# Altium project TLV62569ADRLR-power-board-with-mppt-ic.PrjPcb
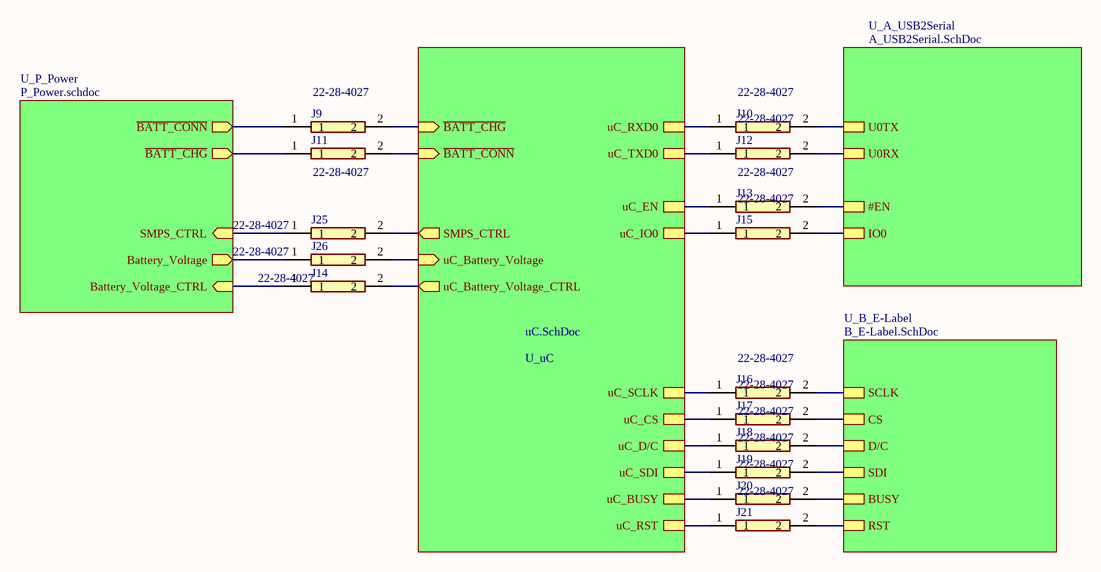
[diagram p0: 0_Top.SchDoc]
5 sheets, 110 parts. Net scope: hierarchical (ports join the sheet entries above them; power ports are global).
Board file: PCB1.PcbDoc
Sheets:
  0_Top.SchDoc
    U_A_USB2Serial = A_USB2Serial.SchDoc
    U_B_E-Label = B_E-Label.SchDoc
    U_P_Power = P_Power.schdoc
    U_uC = uC.SchDoc

## Sheet 0_Top.SchDoc
size A4; DocumentNumber: 1; SheetNumber: 1; SheetTotal: 5

### Parts
J9  22-28-4027  [HDRV2W66P0X254_1X2_508X249X1067P]
J10  22-28-4027  [HDRV2W66P0X254_1X2_508X249X1067P]
J11  22-28-4027  [HDRV2W66P0X254_1X2_508X249X1067P]
J12  22-28-4027  [HDRV2W66P0X254_1X2_508X249X1067P]
J13  22-28-4027  [HDRV2W66P0X254_1X2_508X249X1067P]
J14  22-28-4027  [HDRV2W66P0X254_1X2_508X249X1067P]
J15  22-28-4027  [HDRV2W66P0X254_1X2_508X249X1067P]
J16  22-28-4027  [HDRV2W66P0X254_1X2_508X249X1067P]
J17  22-28-4027  [HDRV2W66P0X254_1X2_508X249X1067P]
J18  22-28-4027  [HDRV2W66P0X254_1X2_508X249X1067P]
J19  22-28-4027  [HDRV2W66P0X254_1X2_508X249X1067P]
J20  22-28-4027  [HDRV2W66P0X254_1X2_508X249X1067P]
J21  22-28-4027  [HDRV2W66P0X254_1X2_508X249X1067P]
J25  22-28-4027  [HDRV2W66P0X254_1X2_508X249X1067P]
J26  22-28-4027  [HDRV2W66P0X254_1X2_508X249X1067P]

### Sub-sheets
U_A_USB2Serial = A_USB2Serial.SchDoc: U0TX, U0RX, #EN, IO0
U_B_E-Label = B_E-Label.SchDoc: SCLK, CS, D/C, SDI, BUSY, RST
U_P_Power = P_Power.schdoc: SMPS_CTRL (in), ~{BATT_CONN} (out), ~{BATT_CHG} (out), Battery_Voltage (out), Battery_Voltage_CTRL (in)
U_uC = uC.SchDoc: uC_TXD0, uC_RXD0, uC_EN, uC_IO0, uC_SDI, uC_CS, uC_D/C, uC_SCLK, uC_BUSY, uC_RST, ~{BATT_CHG} (in), ~{BATT_CONN} (in), SMPS_CTRL (out), uC_Battery_Voltage_CTRL (out), uC_Battery_Voltage (in)

### Nets
#EN: J13.2 ; sheet U_A_USB2Serial/#EN
~{BATT_CHG}: J11.1 ; sheet U_P_Power/~{BATT_CHG}
~{BATT_CONN}: J9.1 ; sheet U_P_Power/~{BATT_CONN}
BUSY: J20.2 ; sheet U_B_E-Label/BUSY
CS: J17.2 ; sheet U_B_E-Label/CS
D/C: J18.2 ; sheet U_B_E-Label/D/C
EN: J13.1 ; sheet U_uC/uC_EN
IO0: J15.2 ; sheet U_A_USB2Serial/IO0
IO2: J20.1 ; sheet U_uC/uC_BUSY
IO3: J21.1 ; sheet U_uC/uC_RST
IO4: J18.1 ; sheet U_uC/uC_D/C
IO5: J9.2 ; sheet U_uC/~{BATT_CHG}
IO6: J11.2 ; sheet U_uC/~{BATT_CONN}
IO7: J26.2 ; sheet U_uC/uC_Battery_Voltage
IO8: J14.2 ; sheet U_uC/uC_Battery_Voltage_CTRL
IO9: J25.2 ; sheet U_uC/SMPS_CTRL
IO13: J16.1 ; sheet U_uC/uC_SCLK
IO14: J19.1 ; sheet U_uC/uC_SDI
IO15: J17.1 ; sheet U_uC/uC_CS
RST: J21.2 ; sheet U_B_E-Label/RST
RXD0: J10.1 ; sheet U_uC/uC_RXD0
SCLK: J16.2 ; sheet U_B_E-Label/SCLK
SDI: J19.2 ; sheet U_B_E-Label/SDI
TXD0: J12.1 ; sheet U_uC/uC_TXD0
U0RX: J12.2 ; sheet U_A_USB2Serial/U0RX
U0TX: J10.2 ; sheet U_A_USB2Serial/U0TX
uC_IO0: J15.1 ; sheet U_uC/uC_IO0
NetJ14_1: J14.1 ; sheet U_P_Power/Battery_Voltage_CTRL
NetJ25_1: J25.1 ; sheet U_P_Power/SMPS_CTRL
NetJ26_1: J26.1 ; sheet U_P_Power/Battery_Voltage

### Library data of the parts
J9-J21 J25 J26 = 22-28-4027: Connector; Manufacturer_Name: Molex; Datasheet Link: https://componentsearchengine.com//22-28-4027.pdf; Height: 10.67mm; Mouser2 Part Number: 538-22-28-4027; Mouser2 Price/Stock: https://www.mouser.com/Search/Refine.aspx?Keyword=538-22-28-4027; Manufacturer_Part_Number: 22-28-4027

## Sheet A_USB2Serial.SchDoc
size A4; DocumentNumber: 3; SheetNumber: 3; SheetTotal: 5
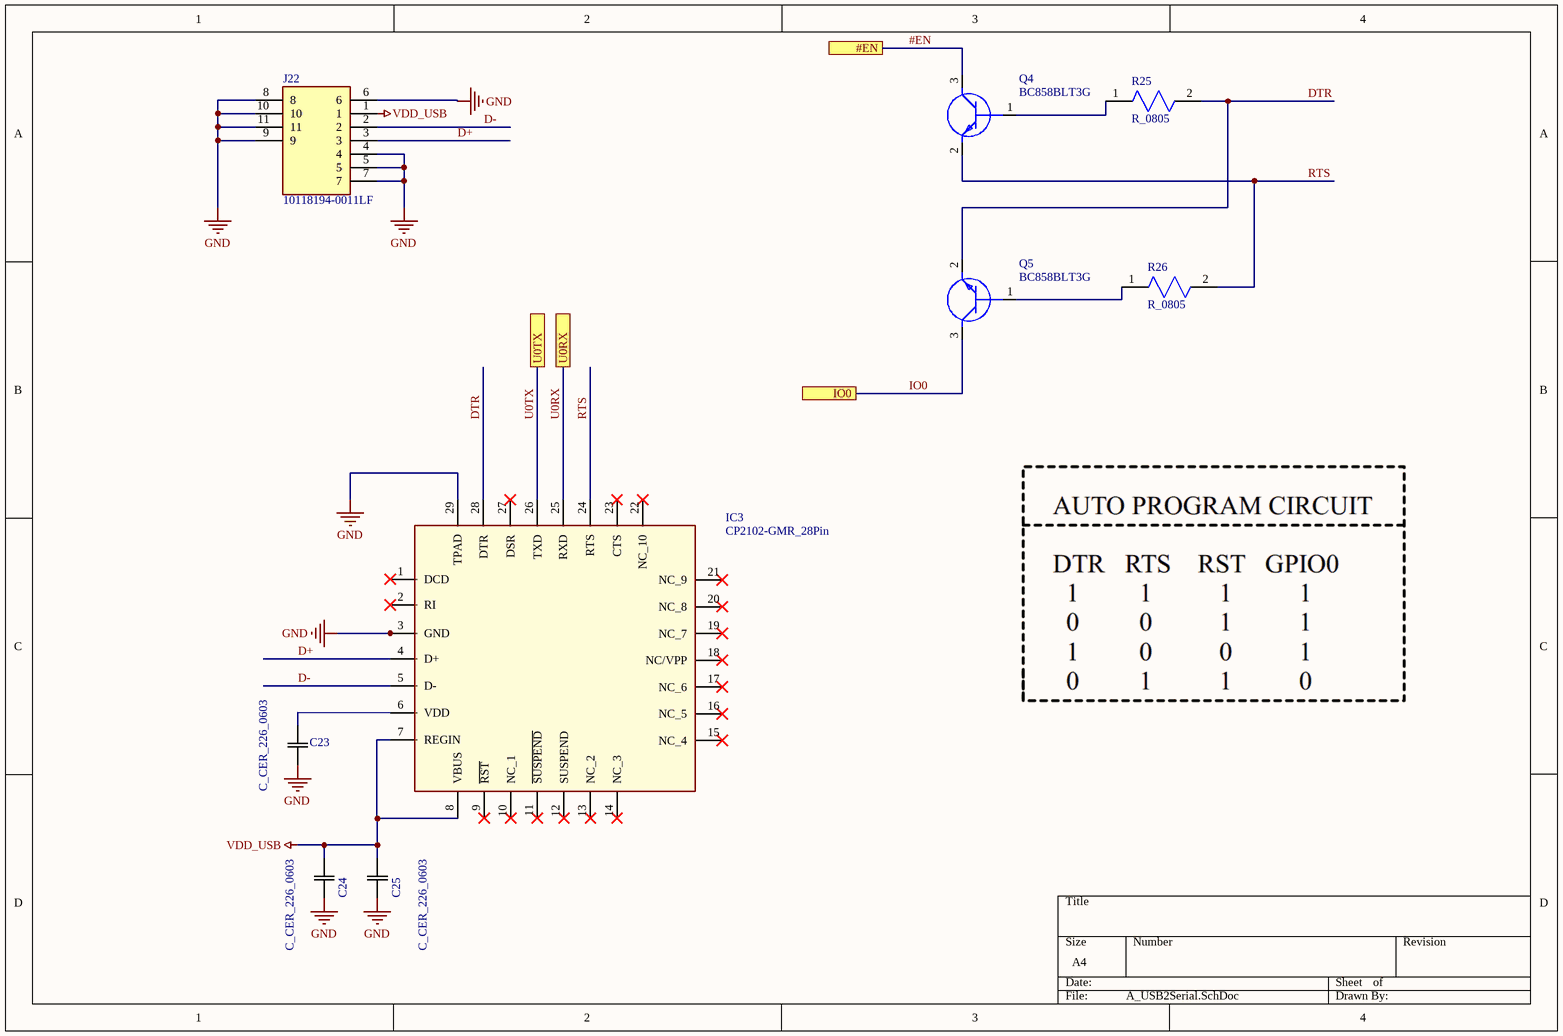
[diagram p1: A_USB2Serial.SchDoc]

### Parts
C23  C_CER_226_0603  [CAPC1608X90N]
C24  C_CER_226_0603  [CAPC1608X90N]
C25  C_CER_226_0603  [CAPC1608X90N]
IC3  CP2102-GMR_28Pin  [QFN50P500X500X100-29N-D]
J22  10118194-0011LF  [101181940011LF]
Q4  BC858BLT3G  [SOT96P237X111-3N]
Q5  BC858BLT3G  [SOT96P237X111-3N]
R25  R_0805  [RESC2012X55N]
R26  R_0805  [RESC2012X55N]

### Ports
#EN, IO0, U0RX, U0TX

### Nets
GND: C23.1 C24.1 C25.1 IC3.3(GND) IC3.29(TPAD) J22.4 J22.5 J22.6 J22.7 J22.8 J22.9 J22.10 J22.11
VDD_USB: C24.2 C25.2 IC3.7(REGIN) IC3.8(VBUS) J22.1
#EN: Q4.3(C) ; port #EN
D+: IC3.4(D+) J22.3
D-: IC3.5(D-) J22.2
DTR: IC3.28(DTR) Q5.2(E) R25.2
IO0: Q5.3(C) ; port IO0
RTS: IC3.24(RTS) Q4.2(E) R26.2
U0RX: IC3.25(RXD) ; port U0RX
U0TX: IC3.26(TXD) ; port U0TX
NetC23_2: C23.2 IC3.6(VDD)
NetQ4_1: Q4.1(B) R25.1
NetQ5_1: Q5.1(B) R26.1

Not connected (* = marked no-connect by the designer): IC3 1(DCD)* 2(RI)* 9(~{RST})* 10(NC_1)* 11(~{SUSPEND})* 12(SUSPEND)* 13(NC_2)* 14(NC_3)* 15(NC_4)* 16(NC_5)* 17(NC_6)* 18(NC/VPP)* 19(NC_7)* 20(NC_8)* 21(NC_9)* 22(NC_10)* 23(CTS)* 27(DSR)*

### Library data of the parts
C23-C25 = C_CER_226_0603: Manufacturer_Part_Number: GRM188R60J226MEA0D; Vendor: Murata; SourceLibrary: Murata_2014-12-31; Type: DEV; Copyright: Copyright (C) 2015 Accelerated Designs. All rights reserved; RefDes: RefDes
IC3 = CP2102-GMR_28Pin: Integrated Circuit; Manufacturer_Name: Silicon Labs; Datasheet Link: https://www.silabs.com/Support%20Documents/TechnicalDocs/CP2102-9.pdf; Height: 1mm; Manufacturer_Part_Number: CP2102-GMR
J22 = 10118194-0011LF: Connector; Manufacturer_Name: Amphenol; Datasheet Link: https://cdn.amphenol-icc.com/media/wysiwyg/files/drawing/10118194.pdf; Height: 2mm; Manufacturer_Part_Number: 10118194-0011LF
Q4 Q5 = BC858BLT3G: Transistor BJT PNP; Manufacturer_Name: ON Semiconductor; Datasheet Link: https://www.onsemi.com/pub/Collateral/BC856ALT1-D.PDF; Height: 1.11mm; Manufacturer_Part_Number: BC858BLT3G
R25 R26 = R_0805: Resistor; Manufacturer_Name: Vishay; Datasheet Link: http://www.vishay.com/docs/20035/dcrcwe3.pdf; Height: 0.4mm

## Sheet B_E-Label.SchDoc
size A4; DocumentNumber: 4; SheetNumber: 4; SheetTotal: 5
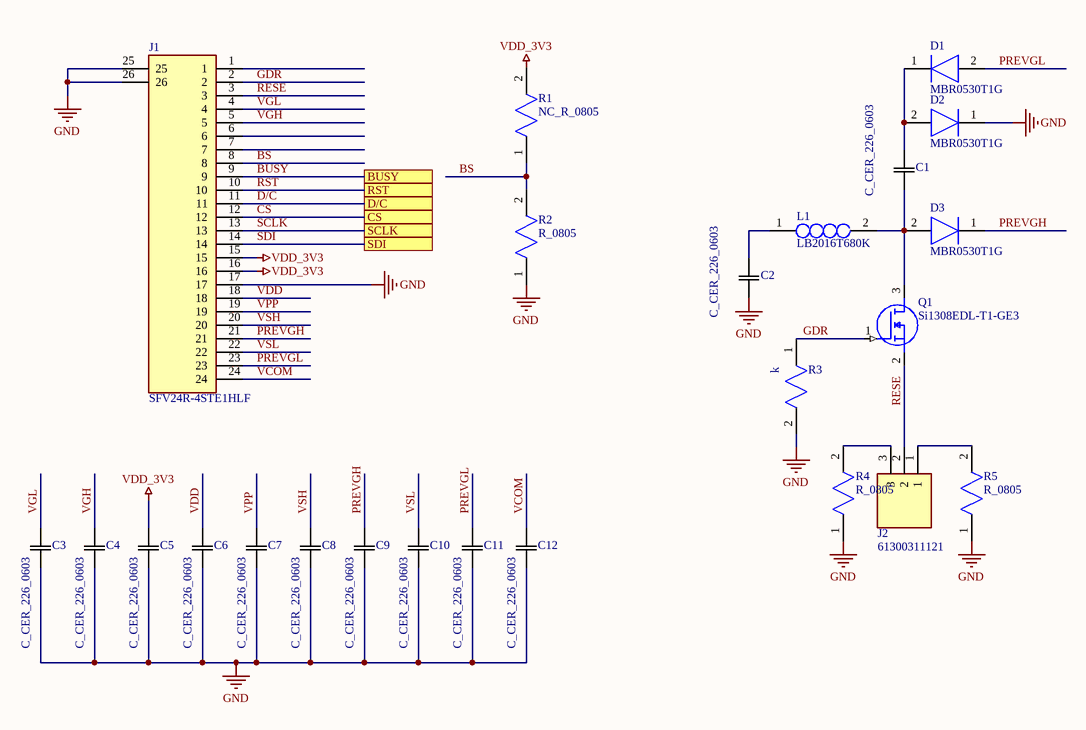
[diagram p2: B_E-Label.SchDoc]

### Parts
C1  C_CER_226_0603  [CAPC1608X90N]
C2  C_CER_226_0603  [CAPC1608X90N]
C3  C_CER_226_0603  [CAPC1608X90N]
C4  C_CER_226_0603  [CAPC1608X90N]
C5  C_CER_226_0603  [CAPC1608X90N]
C6  C_CER_226_0603  [CAPC1608X90N]
C7  C_CER_226_0603  [CAPC1608X90N]
C8  C_CER_226_0603  [CAPC1608X90N]
C9  C_CER_226_0603  [CAPC1608X90N]
C10  C_CER_226_0603  [CAPC1608X90N]
C11  C_CER_226_0603  [CAPC1608X90N]
C12  C_CER_226_0603  [CAPC1608X90N]
D1  MBR0530T1G  [SOD3716X135N]
D2  MBR0530T1G  [SOD3716X135N]
D3  MBR0530T1G  [SOD3716X135N]
J1  SFV24R-4STE1HLF  [SFV24R4STE1HLF]
J2  61300311121  [HDRV3W95P0X254_1X3_762X254X869P]
L1  LB2016T680K  [INDC2218X180N]
Q1  Si1308EDL-T1-GE3  [SOT65P210X110-3N]
R1  NC_R_0805  [RESC2012X55N]
R2  R_0805  [RESC2012X55N]
R3  k  [RESC1005X40N]
R4  R_0805  [RESC2012X55N]
R5  R_0805  [RESC2012X55N]

### Ports
BUSY, CS, D/C, RST, SCLK, SDI

### Nets
GND: C2.1 C3.1 C4.1 C5.1 C6.1 C7.1 C8.1 C9.1 C10.1 C11.1 C12.1 D2.1(K) J1.17 J1.25 J1.26 R2.1 R3.2 R4.1 R5.1
VDD_3V3: C5.2 J1.15 J1.16 R1.2
BS: J1.8 R1.1 R2.2
BUSY: J1.9 ; port BUSY
CS: J1.12 ; port CS
D/C: J1.11 ; port D/C
GDR: J1.2 Q1.1(G) R3.1
PREVGH: C9.2 D3.1(K) J1.21
PREVGL: C11.2 D1.2(A) J1.23
RESE: J1.3 J2.2 Q1.2(S)
RST: J1.10 ; port RST
SCLK: J1.13 ; port SCLK
SDI: J1.14 ; port SDI
VCOM: C12.2 J1.24
VDD: C6.2 J1.18
VGH: C4.2 J1.5
VGL: C3.2 J1.4
VPP: C7.2 J1.19
VSH: C8.2 J1.20
VSL: C10.2 J1.22
NetC1_1: C1.1 D3.2(A) L1.2 Q1.3(D)
NetC1_2: C1.2 D1.1(K) D2.2(A)
NetC2_2: C2.2 L1.1
NetJ2_1: J2.1 R5.2
NetJ2_3: J2.3 R4.2

Not connected (* = marked no-connect by the designer): J1 1 6 7

### Library data of the parts
C1-C12 = C_CER_226_0603: as C23 on sheet A_USB2Serial; Copyright: Copyright (C) 2015 Accelerated Designs. All rights reserved; RefDes: RefDes
D1-D3 = MBR0530T1G: Diode; Manufacturer_Name: ON Semiconductor; Datasheet Link: https://componentsearchengine.com//MBR0530T1G.pdf; Height: 1.35mm; Mouser2 Part Number: 863-MBR0530T1G; Mouser2 Price/Stock: https://www.mouser.com/Search/Refine.aspx?Keyword=863-MBR0530T1G; Manufacturer_Part_Number: MBR0530T1G
J1 = SFV24R-4STE1HLF: Connector; Manufacturer_Name: Amphenol; Datasheet Link: https://www.mouser.co.uk/datasheet/2/18/10117319-1361747.pdf; Height: 2mm; Manufacturer_Part_Number: SFV24R-4STE1HLF
J2 = 61300311121: Connector; Manufacturer_Name: Wurth Elektronik; Datasheet Link: https://componentsearchengine.com//61300311121.pdf; Height: 8.69mm; Mouser2 Part Number: 710-61300311121; Mouser2 Price/Stock: https://www.mouser.com/Search/Refine.aspx?Keyword=710-61300311121; Manufacturer_Part_Number: 61300311121
L1 = LB2016T680K: Inductor; Manufacturer_Name: TAIYO YUDEN; Datasheet Link: https://www.arrow.com/en/products/lb2016t680k/taiyo-yuden; Height: 1.8mm; Manufacturer_Part_Number: LB2016T680K; Arrow Part Number: LB2016T680K
Q1 = Si1308EDL-T1-GE3: MOSFET (N-Channel); Manufacturer_Name: Vishay; Datasheet Link: https://componentsearchengine.com//SI1308EDL-T1-GE3.pdf; Height: 1.1mm; Mouser2 Part Number: 78-SI1308EDL-T1-GE3; Mouser2 Price/Stock: https://www.mouser.com/Search/Refine.aspx?Keyword=78-SI1308EDL-T1-GE3; Manufacturer_Part_Number: Si1308EDL-T1-GE3
R1 R2 R4 R5 = R_0805: Resistor; Manufacturer_Name: Vishay; Datasheet Link: http://www.vishay.com/docs/20035/dcrcwe3.pdf; Height: 0.4mm
R3 = CRCW0402100KFKED: Resistor; Manufacturer_Name: Vishay; Datasheet Link: http://www.vishay.com/docs/20035/dcrcwe3.pdf; Height: 0.4mm; Manufacturer_Part_Number: CRCW0402100KFKED

## Sheet P_Power.schdoc
size 406 x 228 mm; DocumentNumber: 2; SheetNumber: 2; SheetTotal: 5
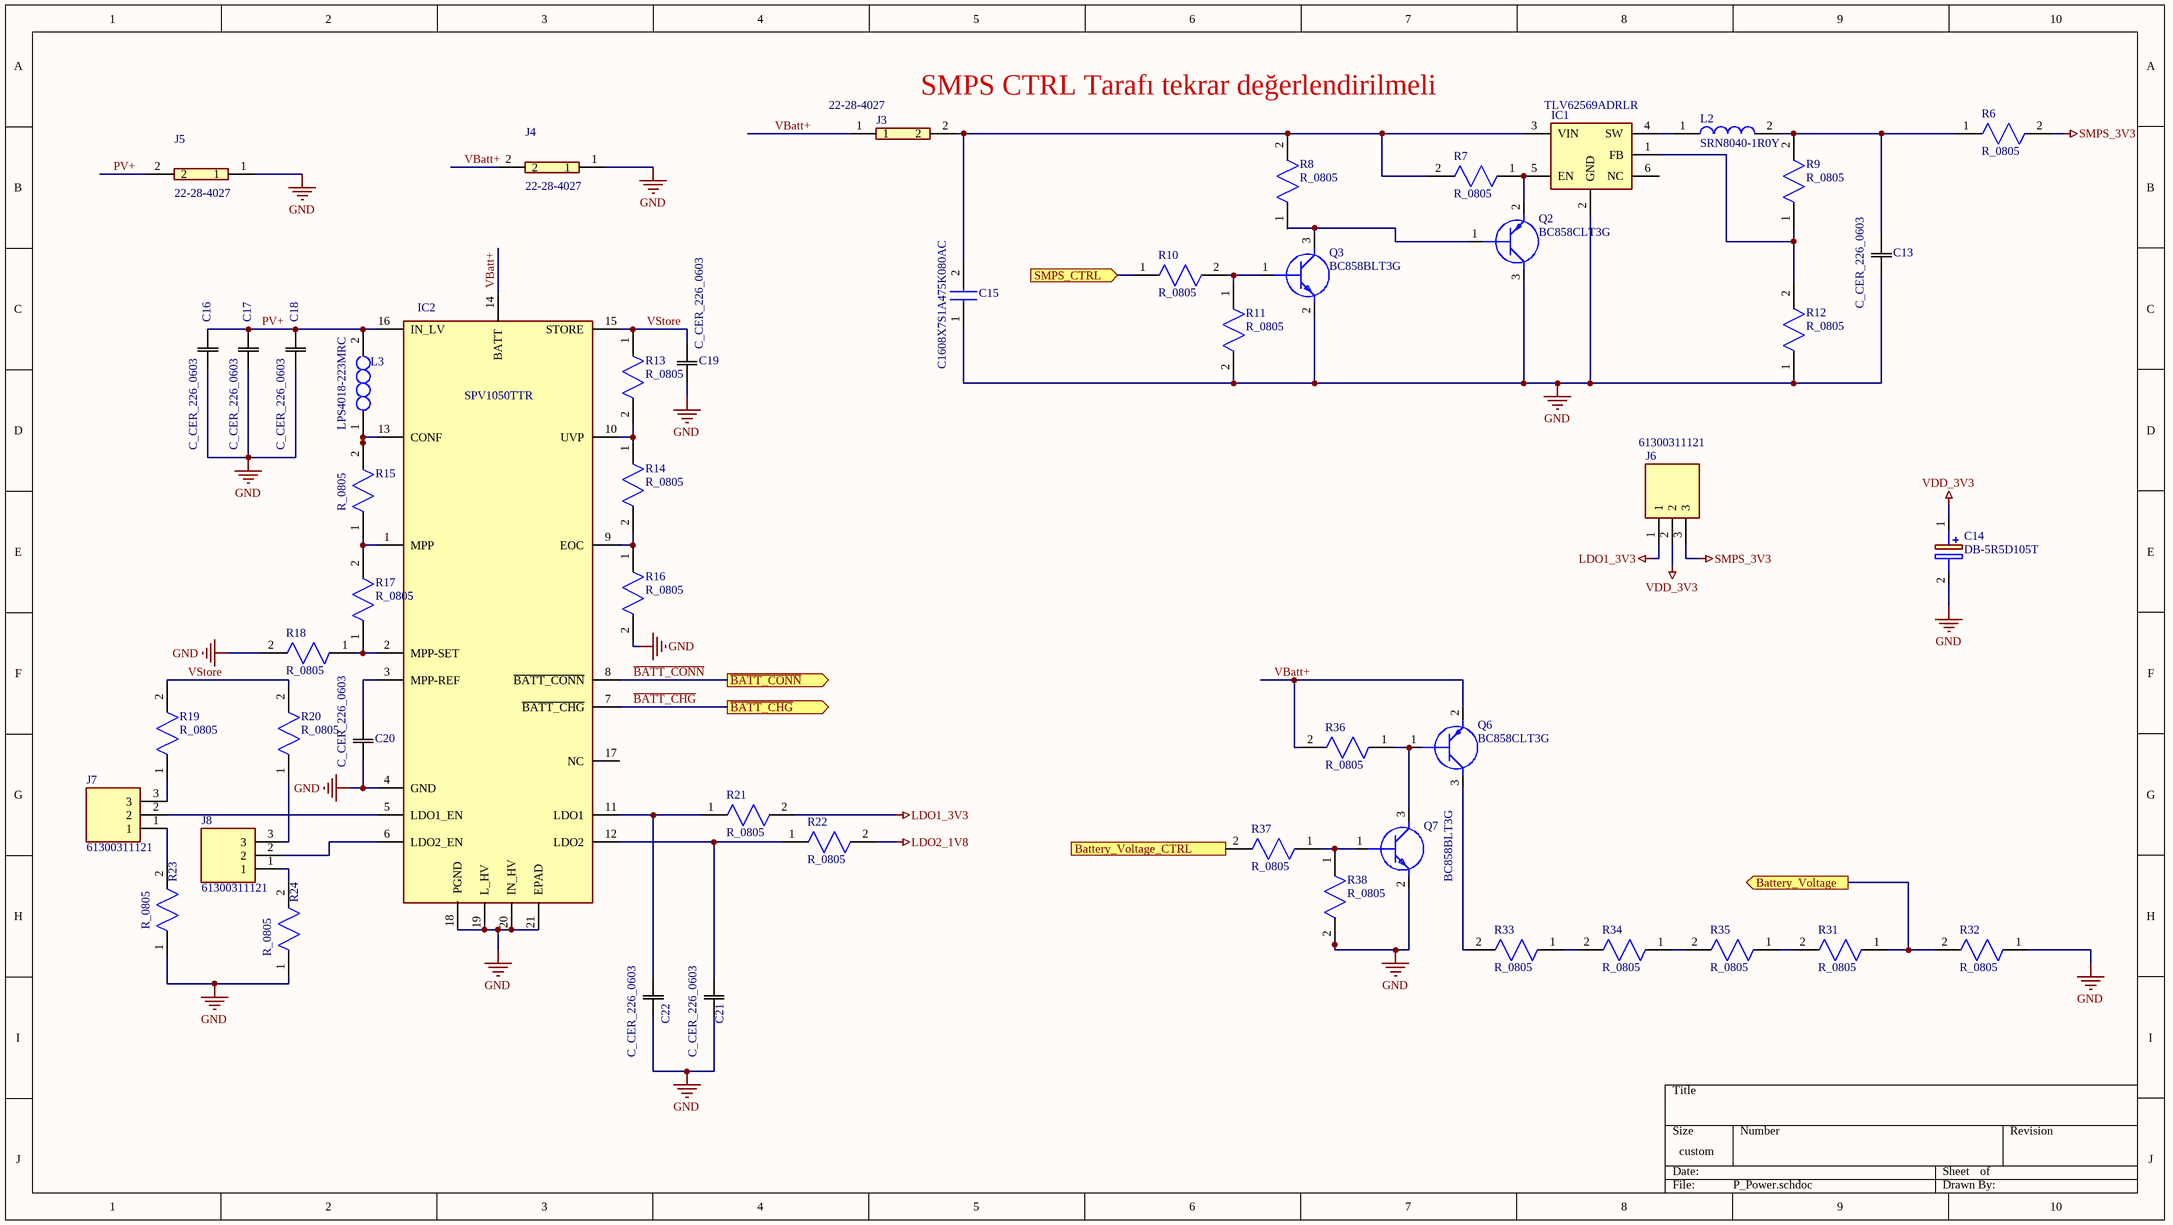
[diagram p3: P_Power.schdoc]

### Parts
C13  C_CER_226_0603  [CAPC1608X90N]
C14  DB-5R5D105T  [CAPPRD500W130D2150H800]
C15  C1608X7S1A475K080AC  [CAPC1608X90N]
C16  C_CER_226_0603  [CAPC1608X90N]
C17  C_CER_226_0603  [CAPC1608X90N]
C18  C_CER_226_0603  [CAPC1608X90N]
C19  C_CER_226_0603  [CAPC1608X90N]
C20  C_CER_226_0603  [CAPC1608X90N]
C21  C_CER_226_0603  [CAPC1608X90N]
C22  C_CER_226_0603  [CAPC1608X90N]
IC1  TLV62569ADRLR  [SOTFL50P160X60-6N]
IC2  SPV1050TTR  [QFN40P300X300X100-21N-D]
J3  22-28-4027  [HDRV2W66P0X254_1X2_508X249X1067P]
J4  22-28-4027  [HDRV2W66P0X254_1X2_508X249X1067P]
J5  22-28-4027  [HDRV2W66P0X254_1X2_508X249X1067P]
J6  61300311121  [HDRV3W95P0X254_1X3_762X254X869P]
J7  61300311121  [HDRV3W95P0X254_1X3_762X254X869P]
J8  61300311121  [HDRV3W95P0X254_1X3_762X254X869P]
L2  SRN8040-1R0Y  [SRN80408R2Y]
L3  LPS4018-223MRC  [LPS4018223MRC]
Q2  BC858CLT3G  [BC858CLT3G]
Q3  BC858BLT3G  [SOT96P237X111-3N]
Q6  BC858CLT3G  [BC858CLT3G]
Q7  BC858BLT3G  [SOT96P237X111-3N]
R6  R_0805  [RESC2012X55N]
R7  R_0805  [RESC2012X55N]
R8  R_0805  [RESC2012X55N]
R9  R_0805  [RESC2012X55N]
R10  R_0805  [RESC2012X55N]
R11  R_0805  [RESC2012X55N]
R12  R_0805  [RESC2012X55N]
R13  R_0805  [RESC2012X55N]
R14  R_0805  [RESC2012X55N]
R15  R_0805  [RESC2012X55N]
R16  R_0805  [RESC2012X55N]
R17  R_0805  [RESC2012X55N]
R18  R_0805  [RESC2012X55N]
R19  R_0805  [RESC2012X55N]
R20  R_0805  [RESC2012X55N]
R21  R_0805  [RESC2012X55N]
R22  R_0805  [RESC2012X55N]
R23  R_0805  [RESC2012X55N]
R24  R_0805  [RESC2012X55N]
R31  R_0805  [RESC2012X55N]
R32  R_0805  [RESC2012X55N]
R33  R_0805  [RESC2012X55N]
R34  R_0805  [RESC2012X55N]
R35  R_0805  [RESC2012X55N]
R36  R_0805  [RESC2012X55N]
R37  R_0805  [RESC2012X55N]
R38  R_0805  [RESC2012X55N]

### Ports
Battery_Voltage (out), Battery_Voltage_CTRL (in), SMPS_CTRL (in), ~{BATT_CHG} (out), ~{BATT_CONN} (out)

### Nets
GND: C13.1 C14.2(-) C15.1 C16.1 C17.1 C18.1 C19.1 C20.1 C21.1 C22.1 IC1.2(GND) IC2.4(GND) IC2.18(PGND) IC2.19(L_HV) IC2.20(IN_HV) IC2.21(EPAD) J4.1 J5.1 Q2.3(C) Q3.2(E) Q7.2(E) R11.2 R12.1 R16.2 R18.2 R23.1 R24.1 R32.1 R38.2
LDO1_3V3: J6.1 R21.2
LDO2_1V8: R22.2
SMPS_3V3: J6.3 R6.2
VDD_3V3: C14.1(+) J6.2
~{BATT_CHG}: IC2.7(~{BATT_CHG}) ; port ~{BATT_CHG}
~{BATT_CONN}: IC2.8(~{BATT_CONN}) ; port ~{BATT_CONN}
PV+: C16.2 C17.2 C18.2 IC2.16(IN_LV) J5.2 L3.2
VBatt+: IC2.14(BATT) J3.1 J4.2 Q6.2(E) R36.2
VStore: C19.2 IC2.15(STORE) R13.1 R19.2 R20.2
NetC13_2: C13.2 L2.2 R6.1 R9.2
NetC15_2: C15.2 IC1.3(VIN) J3.2 R7.2 R8.2
NetC20_2: C20.2 IC2.3(MPP-REF)
NetC21_2: C21.2 IC2.12(LDO2) R22.1
NetC22_2: C22.2 IC2.11(LDO1) R21.1
NetIC1_1: IC1.1(FB) R9.1 R12.2
NetIC1_4: IC1.4(SW) L2.1
NetIC1_5: IC1.5(EN) Q2.2(E) R7.1
NetIC2_1: IC2.1(MPP) R15.1 R17.2
NetIC2_2: IC2.2(MPP-SET) R17.1 R18.1
NetIC2_5: IC2.5(LDO1_EN) J7.2
NetIC2_6: IC2.6(LDO2_EN) J8.2
NetIC2_9: IC2.9(EOC) R14.2 R16.1
NetIC2_10: IC2.10(UVP) R13.2 R14.1
NetIC2_13: IC2.13(CONF) L3.1 R15.2
NetJ7_1: J7.1 R23.2
NetJ7_3: J7.3 R19.1
NetJ8_1: J8.1 R24.2
NetJ8_3: J8.3 R20.1
NetJ14_1: R37.2 ; port Battery_Voltage_CTRL
NetJ25_1: R10.1 ; port SMPS_CTRL
NetJ26_1: R31.1 R32.2 ; port Battery_Voltage
NetQ2_1: Q2.1(B) Q3.3(C) R8.1
NetQ3_1: Q3.1(B) R10.2 R11.1
NetQ6_1: Q6.1(B) Q7.3(C) R36.1
NetQ6_3: Q6.3(C) R33.2
NetQ7_1: Q7.1(B) R37.1 R38.1
NetR31_2: R31.2 R35.1
NetR33_1: R33.1 R34.2
NetR34_1: R34.1 R35.2

Not connected (* = marked no-connect by the designer): IC1 6(NC); IC2 17(NC)

### Notes on the sheet
- SMPS CTRL Tarafı tekrar değerlendirilmeli

### Library data of the parts
C13 C16-C22 = C_CER_226_0603: as C23 on sheet A_USB2Serial; Copyright: Copyright (C) 2015 Accelerated Designs. All rights reserved; RefDes: RefDes
C14 = DB-5R5D105T: Capacitor Polarised; Manufacturer_Name: Elna; Datasheet Link: https://componentsearchengine.com//DB-5R5D105T.pdf; Height: 8mm; Mouser2 Part Number: 555-DB-5R5D105T; Mouser2 Price/Stock: https://www.mouser.com/Search/Refine.aspx?Keyword=555-DB-5R5D105T; Manufacturer_Part_Number: DB-5R5D105T
C15 = C1608X7S1A475K080AC: Capacitor; Manufacturer_Name: TDK; Datasheet Link: https://product.tdk.com/info/en/catalog/datasheets/mlcc_commercial_midvoltage_en.pdf; Height: 0.9mm; Manufacturer_Part_Number: C1608X7S1A475K080AC
IC1 = TLV62569ADRLR: Integrated Circuit; Manufacturer_Name: Texas Instruments; Datasheet Link: http://www.ti.com/lit/gpn/tlv62569a; Height: 0.6mm; Manufacturer_Part_Number: TLV62569ADRLR
IC2 = SPV1050TTR: Integrated Circuit; Manufacturer_Name: STMicroelectronics; Datasheet Link: https://componentsearchengine.com//SPV1050TTR.pdf; Height: 1mm; Mouser2 Part Number: 511-SPV1050TTR; Mouser2 Price/Stock: https://www.mouser.com/Search/Refine.aspx?Keyword=511-SPV1050TTR; Manufacturer_Part_Number: SPV1050TTR
J3-J5 = 22-28-4027: Connector; Manufacturer_Name: Molex; Datasheet Link: https://componentsearchengine.com//22-28-4027.pdf; Height: 10.67mm; Mouser2 Part Number: 538-22-28-4027; Mouser2 Price/Stock: https://www.mouser.com/Search/Refine.aspx?Keyword=538-22-28-4027; Manufacturer_Part_Number: 22-28-4027
J6-J8 = 61300311121: as J2 on sheet B_E-Label; Datasheet Link: https://componentsearchengine.com//61300311121.pdf; Height: 8.69mm; Mouser2 Part Number: 710-61300311121; Mouser2 Price/Stock: https://www.mouser.com/Search/Refine.aspx?Keyword=710-61300311121; Manufacturer_Part_Number: 61300311121
L2 = SRN8040-1R0Y: Inductor; Manufacturer_Name: Bourns; Datasheet Link: https://www.bourns.com/pdfs/SRN8040.pdf; Height: 4mm; Manufacturer_Part_Number: SRN8040-1R0Y
L3 = LPS4018-223MRC: Inductor; Manufacturer_Name: COILCRAFT; Datasheet Link: https://componentsearchengine.com//LPS4018-223MRC.pdf; Height: 1.8mm; Mouser2 Part Number: 994-LPS4018-223MRC; Mouser2 Price/Stock: https://www.mouser.com/Search/Refine.aspx?Keyword=994-LPS4018-223MRC; Manufacturer_Part_Number: LPS4018-223MRC
Q2 Q6 = BC858CLT3G: Transistor BJT PNP; Manufacturer_Name: ON Semiconductor; Datasheet Link: https://componentsearchengine.com//BC858CLT3G.pdf; Mouser2 Part Number: 863-BC858CLT3G; Mouser2 Price/Stock: https://www.mouser.com/Search/Refine.aspx?Keyword=863-BC858CLT3G; Manufacturer_Part_Number: BC858CLT3G
Q3 Q7 = BC858BLT3G: as Q4 on sheet A_USB2Serial; Datasheet Link: https://www.onsemi.com/pub/Collateral/BC856ALT1-D.PDF; Height: 1.11mm; Manufacturer_Part_Number: BC858BLT3G
R6-R24 R31-R38 = R_0805: Resistor; Manufacturer_Name: Vishay; Datasheet Link: http://www.vishay.com/docs/20035/dcrcwe3.pdf; Height: 0.4mm

## Sheet uC.SchDoc
size A4; DocumentNumber: 5; SheetNumber: 5; SheetTotal: 5
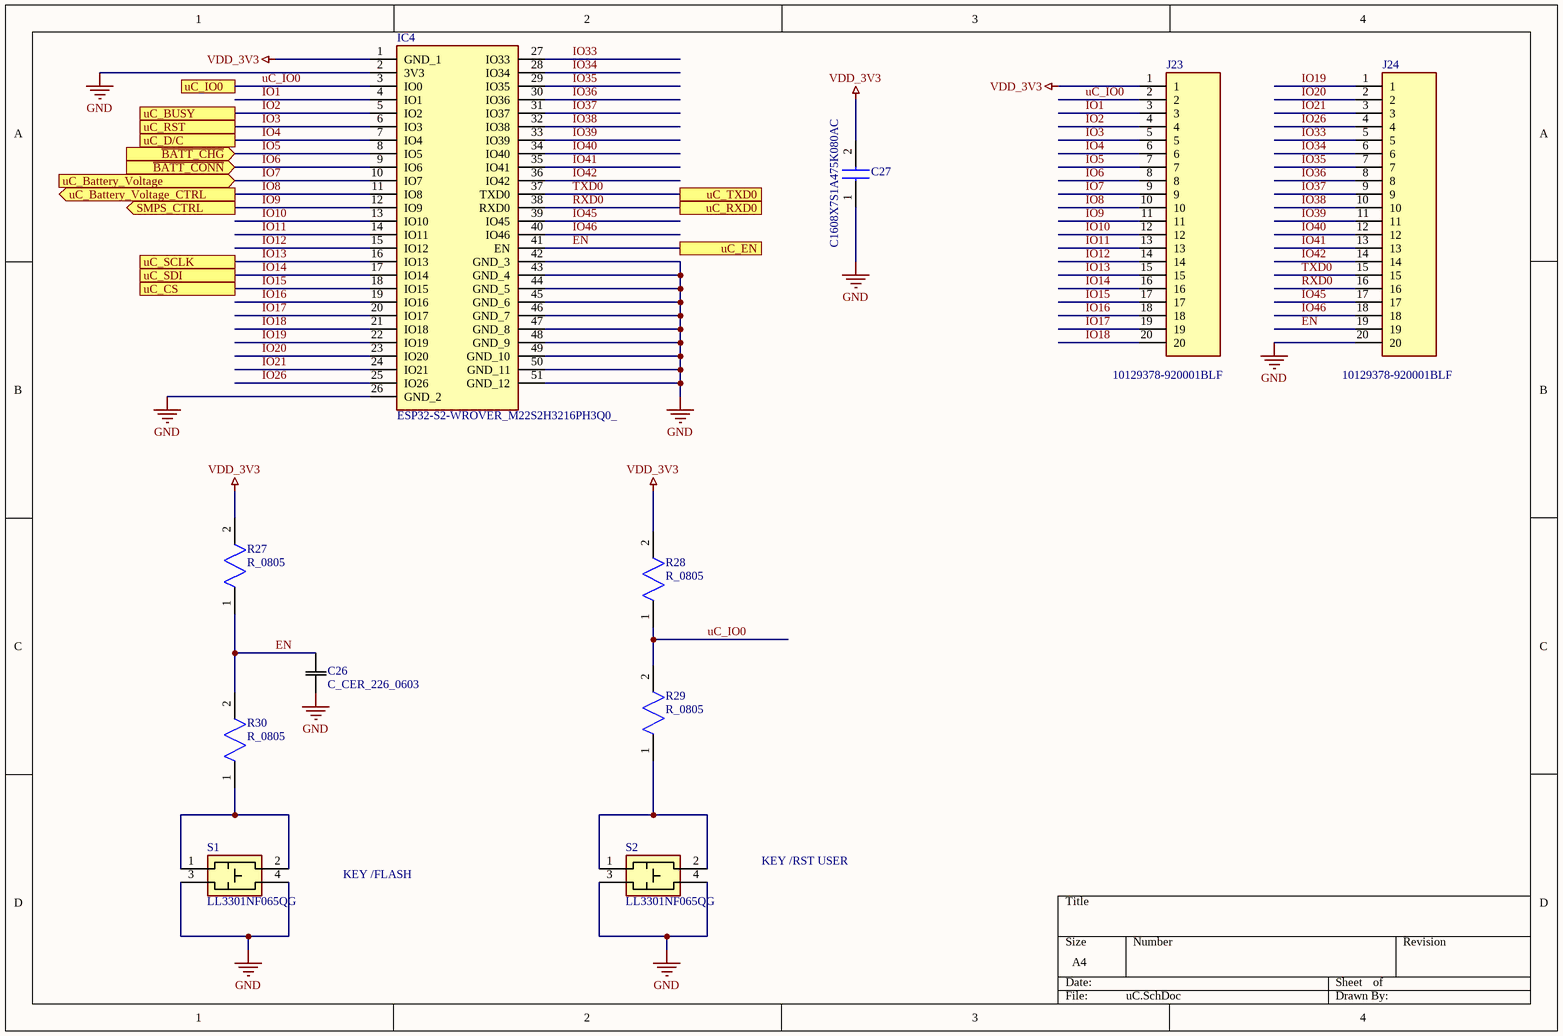
[diagram p4: uC.SchDoc]

### Parts
C26  C_CER_226_0603  [CAPC1608X90N]
C27  C1608X7S1A475K080AC  [CAPC1608X90N]
IC4  ESP32-S2-WROVER_M22S2H3216PH3Q0_  [ESP32S2WROVERM22S2H3216PH3Q0]
J23  10129378-920001BLF  [HDRV20W67P0X254_1X20_5080X241X858P]
J24  10129378-920001BLF  [HDRV20W67P0X254_1X20_5080X241X858P]
R27  R_0805  [RESC2012X55N]
R28  R_0805  [RESC2012X55N]
R29  R_0805  [RESC2012X55N]
R30  R_0805  [RESC2012X55N]
S1  LL3301NF065QG  [LL3301NF065QG]
S2  LL3301NF065QG  [LL3301NF065QG]

### Ports
SMPS_CTRL (out), uC_Battery_Voltage (in), uC_Battery_Voltage_CTRL (out), uC_BUSY, uC_CS, uC_D/C, uC_EN, uC_IO0, uC_RST, uC_RXD0, uC_SCLK, uC_SDI, uC_TXD0, ~{BATT_CHG} (in), ~{BATT_CONN} (in)

### Nets
GND: C26.1 C27.1 IC4.2(3V3) IC4.26(GND_2) IC4.42(GND_3) IC4.43(GND_4) IC4.44(GND_5) IC4.45(GND_6) IC4.46(GND_7) IC4.47(GND_8) IC4.48(GND_9) IC4.49(GND_10) IC4.50(GND_11) IC4.51(GND_12) J24.20 S1.3 S1.4 S2.3 S2.4
VDD_3V3: C27.2 IC4.1(GND_1) J23.1 R27.2 R28.2
EN: C26.2 IC4.41(EN) J24.19 R27.1 R30.2 ; port uC_EN
IO1: IC4.4(IO1) J23.3
IO2: IC4.5(IO2) J23.4 ; port uC_BUSY
IO3: IC4.6(IO3) J23.5 ; port uC_RST
IO4: IC4.7(IO4) J23.6 ; port uC_D/C
IO5: IC4.8(IO5) J23.7 ; port ~{BATT_CHG}
IO6: IC4.9(IO6) J23.8 ; port ~{BATT_CONN}
IO7: IC4.10(IO7) J23.9 ; port uC_Battery_Voltage
IO8: IC4.11(IO8) J23.10 ; port uC_Battery_Voltage_CTRL
IO9: IC4.12(IO9) J23.11 ; port SMPS_CTRL
IO10: IC4.13(IO10) J23.12
IO11: IC4.14(IO11) J23.13
IO12: IC4.15(IO12) J23.14
IO13: IC4.16(IO13) J23.15 ; port uC_SCLK
IO14: IC4.17(IO14) J23.16 ; port uC_SDI
IO15: IC4.18(IO15) J23.17 ; port uC_CS
IO16: IC4.19(IO16) J23.18
IO17: IC4.20(IO17) J23.19
IO18: IC4.21(IO18) J23.20
IO19: IC4.22(IO19) J24.1
IO20: IC4.23(IO20) J24.2
IO21: IC4.24(IO21) J24.3
IO26: IC4.25(IO26) J24.4
IO33: IC4.27(IO33) J24.5
IO34: IC4.28(IO34) J24.6
IO35: IC4.29(IO35) J24.7
IO36: IC4.30(IO36) J24.8
IO37: IC4.31(IO37) J24.9
IO38: IC4.32(IO38) J24.10
IO39: IC4.33(IO39) J24.11
IO40: IC4.34(IO40) J24.12
IO41: IC4.35(IO41) J24.13
IO42: IC4.36(IO42) J24.14
IO45: IC4.39(IO45) J24.17
IO46: IC4.40(IO46) J24.18
RXD0: IC4.38(RXD0) J24.16 ; port uC_RXD0
TXD0: IC4.37(TXD0) J24.15 ; port uC_TXD0
uC_IO0: IC4.3(IO0) J23.2 R28.1 R29.2 ; port uC_IO0
NetR29_1: R29.1 S2.1 S2.2
NetR30_1: R30.1 S1.1 S1.2

### Notes on the sheet
- KEY /FLASH
- KEY /RST USER

### Library data of the parts
C26 = C_CER_226_0603: as C23 on sheet A_USB2Serial; Copyright: Copyright (C) 2015 Accelerated Designs. All rights reserved; RefDes: RefDes
C27 = C1608X7S1A475K080AC: Capacitor; Manufacturer_Name: TDK; Datasheet Link: https://product.tdk.com/info/en/catalog/datasheets/mlcc_commercial_midvoltage_en.pdf; Height: 0.9mm; Manufacturer_Part_Number: C1608X7S1A475K080AC
IC4 = ESP32-S2-WROVER_M22S2H3216PH3Q0_: Integrated Circuit; Manufacturer_Name: Espressif Systems; Manufacturer_Part_Number: ESP32-S2-WROVER(M22S2H3216PH3Q0); Datasheet Link: https://www.espressif.com/sites/default/files/documentation/esp32-s2-wrover_esp32-s2-wrover-i_datasheet_en.pdf; Height: 3.45mm
J23 J24 = 10129378-920001BLF: Connector; Manufacturer_Name: Amphenol; Datasheet Link: https://cdn.amphenol-icc.com/media/wysiwyg/files/drawing/10129378.pdf; Height: 8.58mm; Manufacturer_Part_Number: 10129378-920001BLF
R27-R30 = R_0805: Resistor; Manufacturer_Name: Vishay; Datasheet Link: http://www.vishay.com/docs/20035/dcrcwe3.pdf; Height: 0.4mm
S1 S2 = LL3301NF065QG: Switch; Manufacturer_Name: E-Switch; Datasheet Link: https://componentsearchengine.com//LL3301NF065QG.pdf; Height: 4mm; Mouser2 Part Number: 612-LL3301NF065QG; Mouser2 Price/Stock: https://www.mouser.com/Search/Refine.aspx?Keyword=612-LL3301NF065QG; Manufacturer_Part_Number: LL3301NF065QG

## Nets that join several sheets
GND: A_USB2Serial (13 pins), B_E-Label (19 pins), P_Power (29 pins), uC (19 pins)
VDD_3V3: B_E-Label (C5.2 J1.15 J1.16 R1.2), P_Power (C14.1 J6.2), uC (5 pins)
#EN: 0_Top (J13.2), A_USB2Serial (Q4.3)
~{BATT_CHG}: 0_Top (J11.1), P_Power (IC2.7)
~{BATT_CONN}: 0_Top (J9.1), P_Power (IC2.8)
BUSY: 0_Top (J20.2), B_E-Label (J1.9)
CS: 0_Top (J17.2), B_E-Label (J1.12)
D/C: 0_Top (J18.2), B_E-Label (J1.11)
EN: 0_Top (J13.1), uC (5 pins)
IO0: 0_Top (J15.2), A_USB2Serial (Q5.3)
IO2: 0_Top (J20.1), uC (IC4.5 J23.4)
IO3: 0_Top (J21.1), uC (IC4.6 J23.5)
IO4: 0_Top (J18.1), uC (IC4.7 J23.6)
IO5: 0_Top (J9.2), uC (IC4.8 J23.7)
IO6: 0_Top (J11.2), uC (IC4.9 J23.8)
IO7: 0_Top (J26.2), uC (IC4.10 J23.9)
IO8: 0_Top (J14.2), uC (IC4.11 J23.10)
IO9: 0_Top (J25.2), uC (IC4.12 J23.11)
IO13: 0_Top (J16.1), uC (IC4.16 J23.15)
IO14: 0_Top (J19.1), uC (IC4.17 J23.16)
IO15: 0_Top (J17.1), uC (IC4.18 J23.17)
NetJ14_1: 0_Top (J14.1), P_Power (R37.2)
NetJ25_1: 0_Top (J25.1), P_Power (R10.1)
NetJ26_1: 0_Top (J26.1), P_Power (R31.1 R32.2)
RST: 0_Top (J21.2), B_E-Label (J1.10)
RXD0: 0_Top (J10.1), uC (IC4.38 J24.16)
SCLK: 0_Top (J16.2), B_E-Label (J1.13)
SDI: 0_Top (J19.2), B_E-Label (J1.14)
TXD0: 0_Top (J12.1), uC (IC4.37 J24.15)
U0RX: 0_Top (J12.2), A_USB2Serial (IC3.25)
U0TX: 0_Top (J10.2), A_USB2Serial (IC3.26)
uC_IO0: 0_Top (J15.1), uC (IC4.3 J23.2 R28.1 R29.2)